# Altium schematic sheet 输出采样部分.SchDoc
size A2
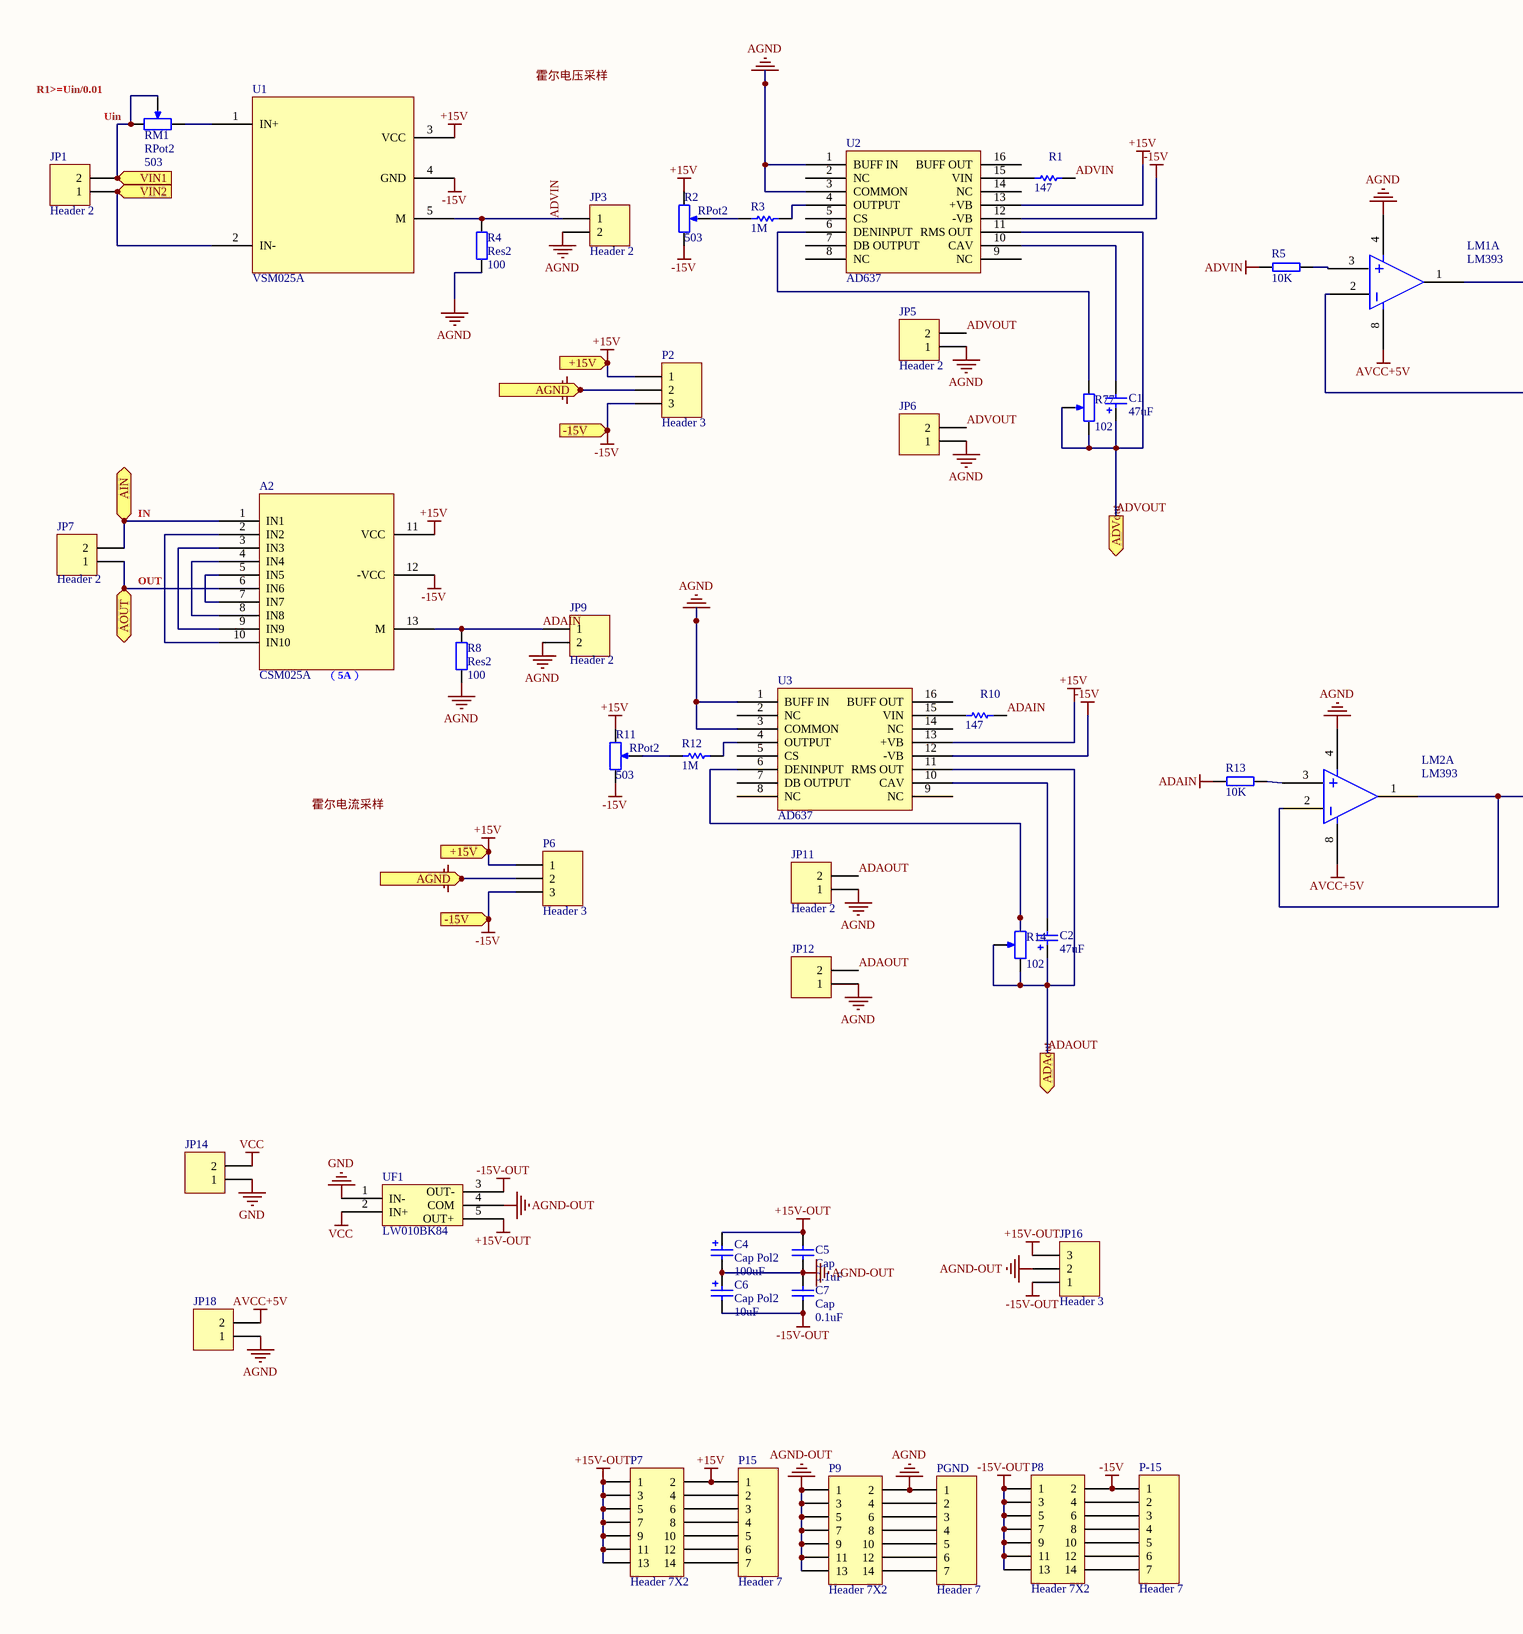
[diagram p0: 输出采样部分.SchDoc, left]
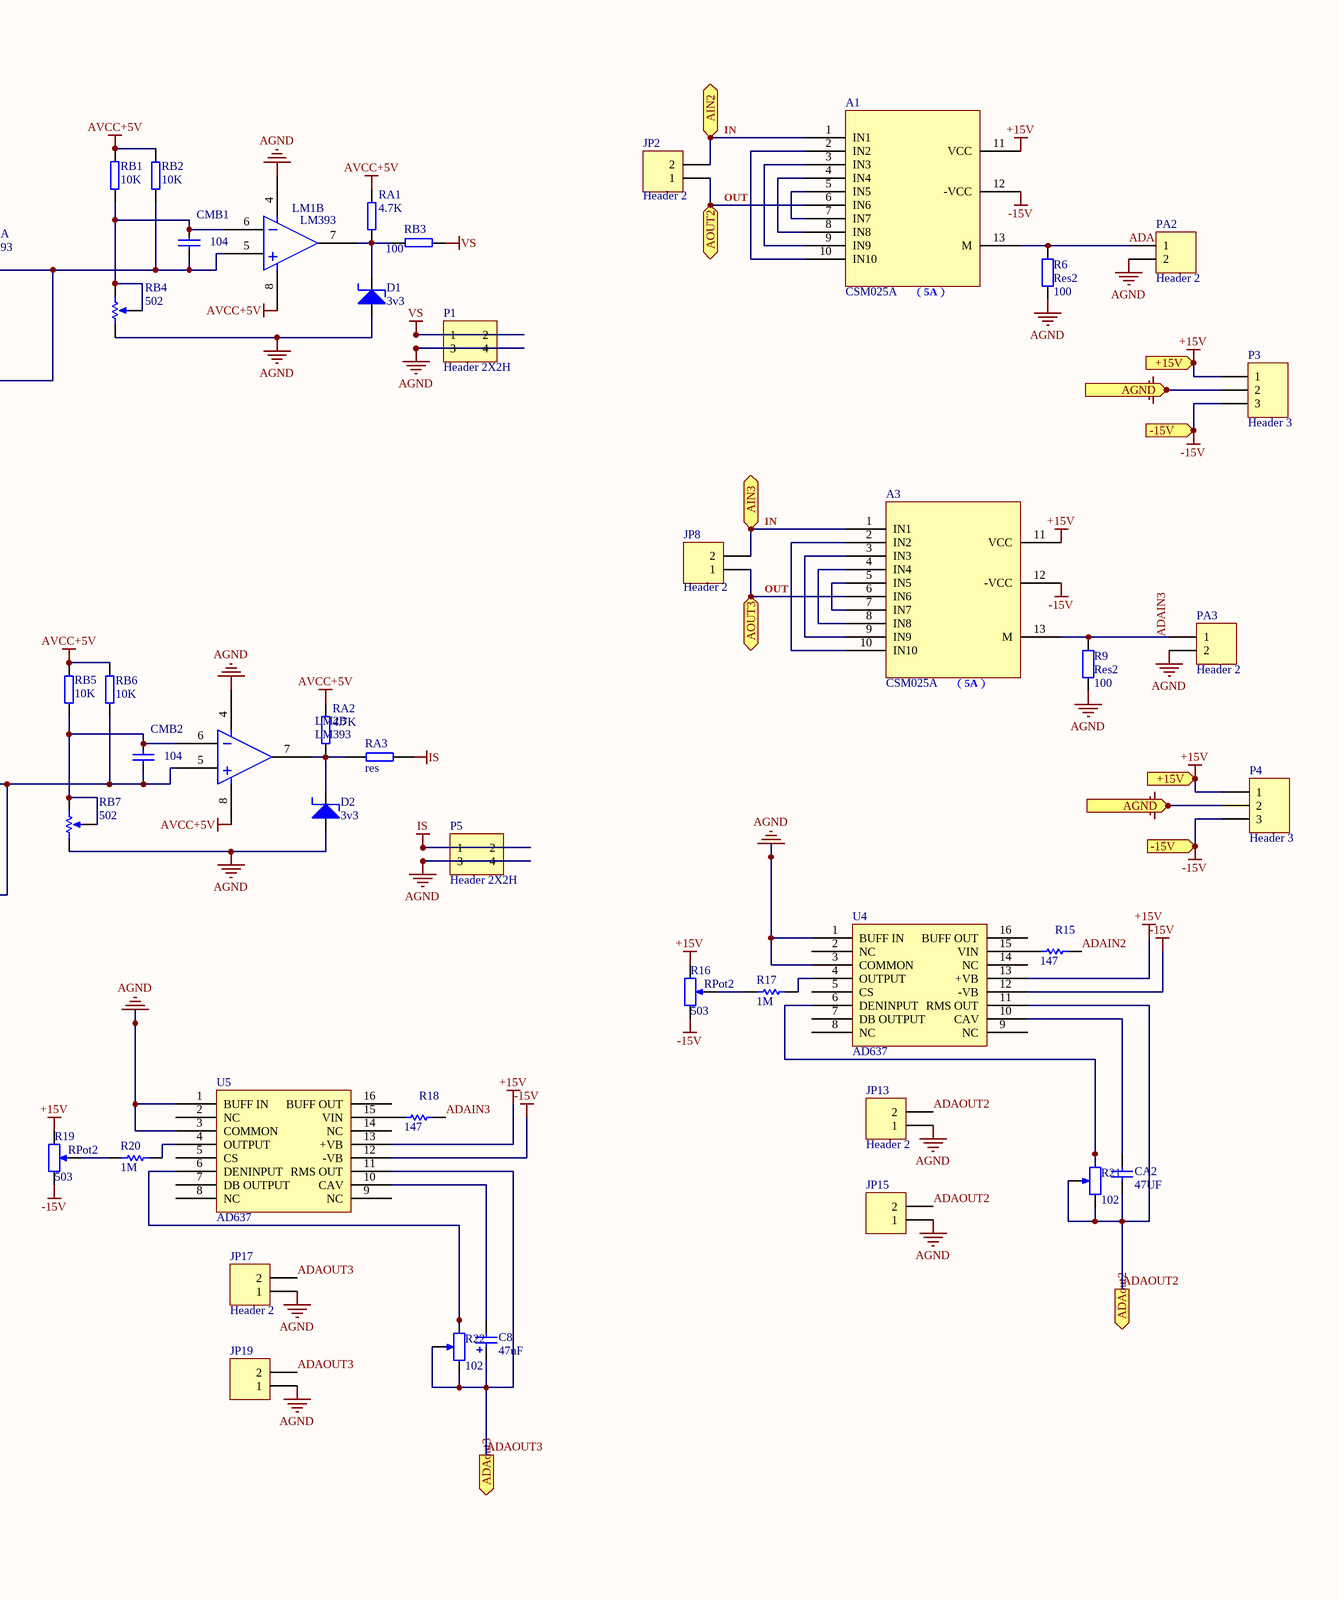
[diagram p1: 输出采样部分.SchDoc, right]

## Parts
A1  CSM025A  [csm025a]
A2  CSM025A  [csm025a]
A3  CSM025A  [csm025a]
C1  47uF  [CAPR5-4X5]
C2  47uF  [CAPR5-4X5]
C4  Cap Pol2  value 100uF  [CAPR2.54-5.1x3.2]
C5  Cap  value 0.1uF  [CAPR2.54-5.1x3.2]
C6  Cap Pol2  value 10uF  [CAPR2.54-5.1x3.2]
C7  Cap  value 0.1uF  [CAPR2.54-5.1x3.2]
C8  47uF  [CAPR5-4X5]
CA2  47UF  [CAP]
CMB1  value 104  [CAP]  (hidden comment: C)
CMB2  value 104  [CAP]  (hidden comment: C)
D1  3v3  [DIO7.1-3.9x1.9]
D2  3v3  [DIO7.1-3.9x1.9]
JP1  Header 2  [tie-in]
JP2  Header 2  [tie-in]
JP3  Header 2  [HDR1X2]
JP5  Header 2  [HDR1X2]
JP6  (no value)  [HDR1X2]
JP7  Header 2  [tie-in]
JP8  Header 2  [tie-in]
JP9  Header 2  [HDR1X2]
JP11  Header 2  [HDR1X2]
JP12  (no value)  [HDR1X2]
JP13  Header 2  [HDR1X2]
JP14  (no value)  [tie-in]
JP15  (no value)  [HDR1X2]
JP16  Header 3  [HDR1X3]
JP17  Header 2  [HDR1X2]
JP18  (no value)  [tie-in]
JP19  (no value)  [HDR1X2]
LM1  LM393  [DIP8]  (parts A,B of 2)
LM2  LM393  [DIP8]  (parts A,B of 2)
P1  Header 2X2H  [HDR2X2H]
P2  Header 3  [HDR1X3]
P3  Header 3  [HDR1X3]
P4  Header 3  [HDR1X3]
P5  Header 2X2H  [HDR2X2H]
P6  Header 3  [HDR1X3]
P7  Header 7X2  [HDR2X7]
P8  Header 7X2  [HDR2X7]
P9  Header 7X2  [HDR2X7]
P15  Header 7  [HDR1X7]
P-15  Header 7  [HDR1X7]
PA2  Header 2  [HDR1X2]
PA3  Header 2  [HDR1X2]
PGND  Header 7  [HDR1X7]
R1  147  [RES]
R2  RPot2  value 503  [滑阻]
R3  1M  [RES]
R4  Res2  value 100  [RES]
R5  value 10K  [RES]  (hidden comment: R)
R6  Res2  value 100  [RES]
R8  Res2  value 100  [RES]
R9  Res2  value 100  [RES]
R10  147  [RES]
R11  RPot2  value 503  [滑阻]
R12  1M  [RES]
R13  value 10K  [RES]  (hidden comment: R)
R14  value 102  [滑阻]
R15  147  [RES]
R16  RPot2  value 503  [滑阻]
R17  1M  [RES]
R18  147  [RES]
R19  RPot2  value 503  [滑阻]
R20  1M  [RES]
R21  value 102  [滑阻]
R22  value 102  [滑阻]
R77  102  [滑阻]
RA1  value 4.7K  [RES]  (hidden comment: R)
RA2  value 4.7K  [RES]  (hidden comment: R)
RA3  res  [RES]
RB1  value 10K  [RES]  (hidden comment: R)
RB2  value 10K  [RES]  (hidden comment: R)
RB3  100  [RES]
RB4  value 502  [VR5]  (hidden comment: 504)
RB5  value 10K  [RES]  (hidden comment: R)
RB6  value 10K  [RES]  (hidden comment: R)
RB7  value 502  [VR5]  (hidden comment: 504)
RM1  RPot2  value 503  [滑阻]
U1  VSM025A  [vsm025a]
U2  AD637  [AD637转接板]
U3  AD637  [AD637转接板]
U4  AD637  [AD637转接板]
U5  AD637  [AD637转接板]
UF1  LW010BK84  [LW010BK84]

## Ports
+15V (in), -15V (in), ADAout2 (out), ADAout3 (out), ADAout (out), ADVout (out), AGND (in), AIN2 (in), AIN3 (in), AIN (in), AOUT2 (in), AOUT3 (in), AOUT (in), VIN1 (in), VIN2 (in)

## Nets
+15V: A1.11(VCC) A2.11(VCC) A3.11(VCC) P2.1 P3.1 P4.1 P6.1 P7.2 P15.1 R2.2(BOT) R11.2(BOT) R16.2(BOT) R19.2(BOT) U1.3(VCC) U2.13(+VB) U3.13(+VB) U4.13(+VB) U5.13(+VB) ; port +15V
+15V-OUT: C4.1 C5.2 JP16.3 P7.1 P7.3 P7.5 P7.7 P7.9 P7.11 P7.13 UF1.5(OUT+)
-15V: A1.12(-VCC) A2.12(-VCC) A3.12(-VCC) P2.3 P3.3 P4.3 P6.3 P8.2 P-15.1 R2.1(TOP) R11.1(TOP) R16.1(TOP) R19.1(TOP) U1.4(GND) U2.12(-VB) U3.12(-VB) U4.12(-VB) U5.12(-VB) ; port -15V
-15V-OUT: C6.2 C7.1 JP16.1 P8.1 P8.3 P8.5 P8.7 P8.9 P8.11 P8.13 UF1.3(OUT-)
ADAIN: A2.13(M) JP9.1 R8.2 R10.2 R13.2
ADVIN: JP3.1 R1.2 R4.2 R5.2 U1.5(M)
AGND: D1.1(A) D2.1(A) JP3.2 JP5.1 JP6.1 JP9.2 JP11.1 JP12.1 JP13.1 JP15.1 JP17.1 JP18.1 JP19.1 LM1.4 LM2.4 P1.3 P1.4 P2.2 P3.2 P4.2 P5.3 P5.4 P6.2 P9.2 PA2.2 PA3.2 PGND.1 R4.1 R6.1 R8.1 R9.1 RB4.1(TOP) RB7.1(TOP) U2.1(BUFF_IN) U2.3(COMMON) U3.1(BUFF_IN) U3.3(COMMON) U4.1(BUFF_IN) U4.3(COMMON) U5.1(BUFF_IN) U5.3(COMMON) ; port AGND
AGND-OUT: C4.2 C5.1 C6.1 C7.2 JP16.2 P9.1 P9.3 P9.5 P9.7 P9.9 P9.11 P9.13 UF1.4(COM)
AVCC+5V: JP18.2 LM1.8 LM2.8 RA1.2 RA2.2 RB1.1 RB2.2 RB5.1 RB6.2
GND: JP14.1 UF1.1(IN-)
IS: P5.1 P5.2 RA3.2
VCC: JP14.2 UF1.2(IN+)
VS: P1.1 P1.2 RB3.1
ADAIN2: A1.13(M) PA2.1 R6.2 R15.2
ADAIN3: A3.13(M) PA3.1 R9.2 R18.2
ADAOUT: C2.1 JP11.2 JP12.2 R14.2(BOT) R14.3(TAP) U3.11(RMS_OUT) ; port ADAout
ADAOUT2: CA2.1 JP13.2 JP15.2 R21.2(BOT) R21.3(TAP) U4.11(RMS_OUT) ; port ADAout2
ADAOUT3: C8.1 JP17.2 JP19.2 R22.2(BOT) R22.3(TAP) U5.11(RMS_OUT) ; port ADAout3
ADVOUT: C1.1 JP5.2 JP6.2 R77.1(TOP) R77.3(TAP) U2.11(RMS_OUT) ; port ADVout
AIN: A2.1(IN1) JP7.2 ; port AIN
AIN2: A1.1(IN1) JP2.2 ; port AIN2
AIN3: A3.1(IN1) JP8.2 ; port AIN3
AOUT: A2.6(IN6) JP7.1 ; port AOUT
AOUT2: A1.6(IN6) JP2.1 ; port AOUT2
AOUT3: A3.6(IN6) JP8.1 ; port AOUT3
VIN1: JP1.2 RM1.2(BOT) RM1.3(TAP) ; port VIN1
VIN2: JP1.1 U1.2(IN-) ; port VIN2
NetA1_2: A1.2(IN2) A1.10(IN10)
NetA1_3: A1.3(IN3) A1.9(IN9)
NetA1_4: A1.4(IN4) A1.8(IN8)
NetA1_5: A1.5(IN5) A1.7(IN7)
NetA2_2: A2.2(IN2) A2.10(IN10)
NetA2_3: A2.3(IN3) A2.9(IN9)
NetA2_4: A2.4(IN4) A2.8(IN8)
NetA2_5: A2.5(IN5) A2.7(IN7)
NetA3_2: A3.2(IN2) A3.10(IN10)
NetA3_3: A3.3(IN3) A3.9(IN9)
NetA3_4: A3.4(IN4) A3.8(IN8)
NetA3_5: A3.5(IN5) A3.7(IN7)
NetC1_2: C1.2 U2.10(CAV)
NetC2_2: C2.2 U3.10(CAV)
NetC8_2: C8.2 U5.10(CAV)
NetCA2_2: CA2.2 U4.10(CAV)
NetCMB1_1: CMB1.1 LM1.6 RB1.2 RB4.2(BOT) RB4.3(TAP)
NetCMB1_2: CMB1.2 LM1.1 LM1.2 LM1.5 RB2.1
NetCMB2_1: CMB2.1 LM2.6 RB5.2 RB7.2(BOT) RB7.3(TAP)
NetCMB2_2: CMB2.2 LM2.1 LM2.2 LM2.5 RB6.1
NetD1_2: D1.2(K) LM1.7 RA1.1 RB3.2
NetD2_2: D2.2(K) LM2.7 RA2.1 RA3.1
NetLM1_3: LM1.3 R5.1
NetLM2_3: LM2.3 R13.1
NetP7_4: P7.4 P15.2
NetP7_6: P7.6 P15.3
NetP7_8: P7.8 P15.4
NetP7_10: P7.10 P15.5
NetP7_12: P7.12 P15.6
NetP7_14: P7.14 P15.7
NetP8_4: P8.4 P-15.2
NetP8_6: P8.6 P-15.3
NetP8_8: P8.8 P-15.4
NetP8_10: P8.10 P-15.5
NetP8_12: P8.12 P-15.6
NetP8_14: P8.14 P-15.7
NetP9_4: P9.4 PGND.2
NetP9_6: P9.6 PGND.3
NetP9_8: P9.8 PGND.4
NetP9_10: P9.10 PGND.5
NetP9_12: P9.12 PGND.6
NetP9_14: P9.14 PGND.7
NetR1_1: R1.1 U2.15(VIN)
NetR2_3: R2.3(TAP) R3.1
NetR3_2: R3.2 U2.4(OUTPUT)
NetR10_1: R10.1 U3.15(VIN)
NetR11_3: R11.3(TAP) R12.1
NetR12_2: R12.2 U3.4(OUTPUT)
NetR14_1: R14.1(TOP) U3.6(DENINPUT)
NetR15_1: R15.1 U4.15(VIN)
NetR16_3: R16.3(TAP) R17.1
NetR17_2: R17.2 U4.4(OUTPUT)
NetR18_1: R18.1 U5.15(VIN)
NetR19_3: R19.3(TAP) R20.1
NetR20_2: R20.2 U5.4(OUTPUT)
NetR21_1: R21.1(TOP) U4.6(DENINPUT)
NetR22_1: R22.1(TOP) U5.6(DENINPUT)
NetR77_2: R77.2(BOT) U2.6(DENINPUT)
NetRM1_1: RM1.1(TOP) U1.1(IN+)

Not connected (* = marked no-connect by the designer): U2 2(NC) 5(CS) 7(DB_OUTPUT) 8(NC) 9(NC) 14(NC) 16(BUFF_OUT); U3 2(NC) 5(CS) 7(DB_OUTPUT) 8(NC) 9(NC) 14(NC) 16(BUFF_OUT); U4 2(NC) 5(CS) 7(DB_OUTPUT) 8(NC) 9(NC) 14(NC) 16(BUFF_OUT); U5 2(NC) 5(CS) 7(DB_OUTPUT) 8(NC) 9(NC) 14(NC) 16(BUFF_OUT)

## Notes on the sheet
- (near RM1) R1>=Uin/0.01
- (near RM1) Uin
- (near JP2) IN
- (near JP2) OUT
- (near A1) （5A）
- (near JP7) IN
- (near JP8) IN
- (near JP7) OUT
- (near JP8) OUT
- (near A2) （5A）
- (near A3) （5A）
- Labels drawn without touching a wire or pin: 霍尔电压采样, 霍尔电流采样

## Library data of the parts
C1 C2 C8 = Cap Pol1: Polarized Capacitor (Radial); Published: 8-Jun-2000; LatestRevisionDate: 17-Jul-2002; LatestRevisionNote: Re-released for DXP Platform.; Publisher: Altium Limited
C4 C6 = Cap Pol2: Polarized Capacitor (Axial); Manufacturer: Generic Components; Class: Passive; Published: 08/06/2000; Publisher: Altium Hobart Technology Centre; SubClass: Capacitor
C5 C7 = Cap: Capacitor; Manufacturer: Generic Components; Class: Passive; Published: 08/06/2000; Publisher: Altium Hobart Technology Centre; SubClass: Capacitor
CA2 = CAP
CMB1 CMB2 = CC: 瓷片/无极电容
D1 D2 = 稳压二极管
JP1-JP3 JP5-JP9 JP11-JP15 JP17-JP19 = Header 2: Header, 2-Pin; Manufacturer: Generic Components; Class: Connector
JP16 = Header 3: Header, 3-Pin; Manufacturer: Generic Components; Class: Connector
P1 P5 = Header 2X2H: Header, 2-Pin, Dual row, Right Angle; LatestRevisionDate: 17-Jul-2002; LatestRevisionNote: Re-released for DXP Platform.; Publisher: Altium Limited
P2-P4 P6 = Header 3: Header, 3-Pin; LatestRevisionDate: 17-Jul-2002; LatestRevisionNote: Re-released for DXP Platform.; Publisher: Altium Limited
P7-P9 = Header 7X2: Header, 7-Pin, Dual row; LatestRevisionDate: 17-Jul-2002; LatestRevisionNote: Re-released for DXP Platform.; Publisher: Altium Limited
P15 P-15 PGND = Header 7: Header, 7-Pin; LatestRevisionDate: 17-Jul-2002; LatestRevisionNote: Re-released for DXP Platform.; Publisher: Altium Limited
PA2 PA3 = Header 2: Header, 2-Pin; LatestRevisionDate: 17-Jul-2002; LatestRevisionNote: Re-released for DXP Platform.; Publisher: Altium Limited
R1 R3 R10 R12 R15 R17 R18 R20 = Res1: Resistor; Published: 8-Jun-2000; LatestRevisionDate: 17-Jul-2002; LatestRevisionNote: Re-released for DXP Platform.; Publisher: Altium Limited
R2 R11 R14 R16 R19 R21 R22 R77 RM1 = RPot2: Potentiometer; Manufacturer: Generic Components; Class: Passive; Set Position: 0.5; Published: 08/06/2000; Publisher: Altium Hobart Technology Centre; SubClass: Potentiometer
  R77: Value: 102
R4 R6 R8 R9 = Res2: Resistor; Manufacturer: Generic Components; Class: Passive; Published: 08/06/2000; Publisher: Altium Hobart Technology Centre; SubClass: Resistor
RB3 = R: Value: NC
RB4 RB7 = RPot: Potentiometer; Sim Note: Enter the Resistance value and the set point into parameter fields.; Set Position: 0.5; Published: 8-Jun-2000; LatestRevisionDate: 17-Jul-2002; LatestRevisionNote: Re-released for DXP Platform.; PackageReference: VR5; Publisher: Altium Limited